# Altium schematic sheet KorszeOBD.SchDoc
size A4
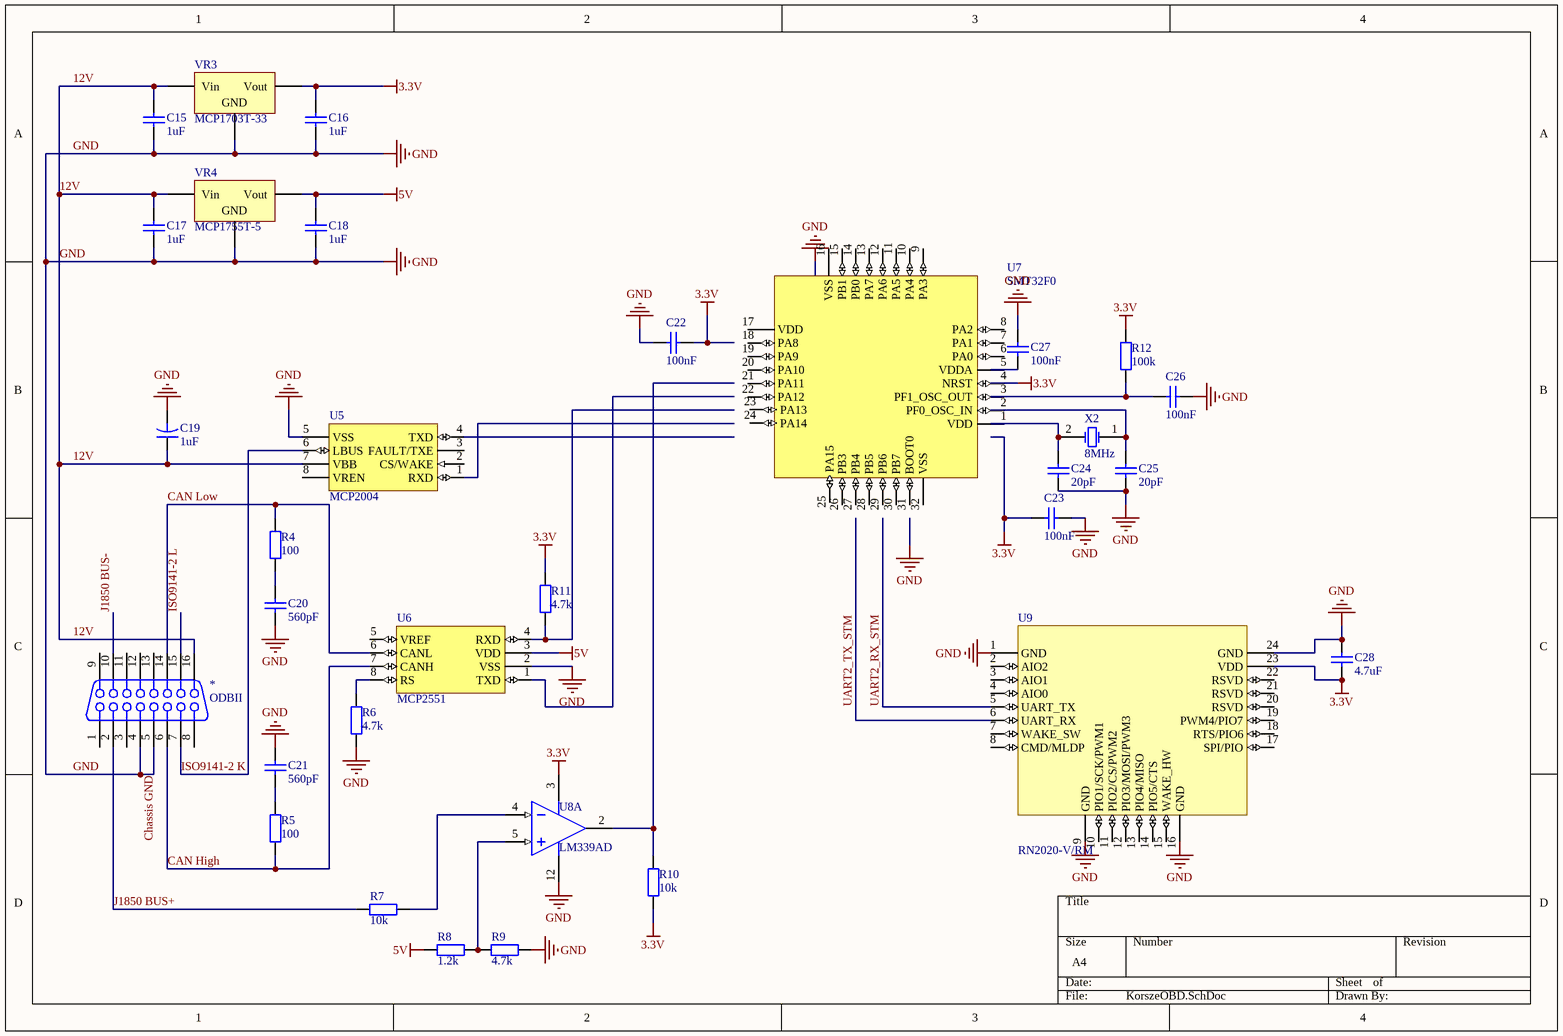
[diagram p0: KorszeOBD.SchDoc]

## Parts
*  ODBII  [HDR2X8H]
C15  1uF  [0402]
C16  1uF  [0402]
C17  1uF  [0402]
C18  1uF  [0402]
C19  1uF  [0402]
C20  560pF  [0402]
C21  560pF  [0402]
C22  100nF  [0402]
C23  100nF  [0402]
C24  20pF  [0402]
C25  20pF  [0402]
C26  100nF  [0402]
C27  100nF  [0402]
C28  4.7uF  [0402]
R4  100  [J1-0603]
R5  100  [J1-0603]
R6  4.7k  [J1-0603]
R7  10k  [J1-0603]
R8  1.2k  [J1-0603]
R9  4.7k  [J1-0603]
R10  10k  [J1-0603]
R11  4.7k  [J1-0603]
R12  100k  [J1-0603]
U5  MCP2004  [SO8_M]
U6  MCP2551  [SO8W_M]
U7  SMT32F0  [Model Name]
U8  LM339AD  [SO14_M]  (part A of 4)
U9  RN2020-V/RM  [RN4020 MODULE-24]
VR3  MCP1703T-33  [SOT23_M]
VR4  MCP1755T-5  [SOT23-6_M]
X2  8MHz  [R38]

## Nets
3.3V: C16.2 C22.2 C23.2 C28.1 R10.2 R11.1 R12.2 U7.4(NRST) U8.3(V+) U9.23(VDD) VR3.3(Vout)
5V: C18.2 R8.2 U6.3(VDD) VR4.3(Vout)
12V: *.4 *.5 *.16 C15.1 C15.2 C16.1 C17.1 C17.2 C18.1 C19.1 C19.2 C20.1 C21.2 C22.1 C23.1 C24.2 C25.2 C26.2 C27.2 C28.2 R6.1 R9.1 U5.5(VSS) U5.7(VBB) U6.2(VSS) U8.12(V-) U9.1(GND) U9.9(GND) U9.16(GND) U9.24(GND) VR3.1(Vin) VR3.2(GND) VR4.1(Vin) VR4.2(GND)  [also labelled Chassis GND, GND]
CAN High: *.6 R5.1 U6.7(CANH)
CAN Low: *.14 R4.2 U6.6(CANL)
ISO9141-2 K: *.7 U5.6(LBUS)
ISO9141-2 L: *.15
J1850 BUS+: *.2 R7.1
J1850 BUS-: *.10
UART2_RX_STM: U9.5(UART_TX)
UART2_TX_STM: U9.6(UART_RX)
NetC20_2: C20.2 R4.1
NetC21_1: C21.1 R5.2
NetC24_1: C24.1 U7.1(VDD) X2.2(OSC2)
NetC25_1: C25.1 U7.2(PF0_OSC_IN) X2.1(OSC1)
NetC26_1: C26.1 R12.1 U7.3(PF1_OSC_OUT)
NetC27_1: C27.1 U7.5(VDDA)
NetR6_2: R6.2 U6.8(RS)
NetR7_2: R7.2 U8.4(IN-)
NetR8_1: R8.1 R9.2 U8.5(IN+)
NetR10_1: R10.1 U8.2(OUT)
NetR11_2: R11.2 U6.4(RXD)

Not connected (* = marked no-connect by the designer): * 1 3 8 9 11 12 13; U5 1(RXD) 2(CS/WAKE) 3(FAULT/TXE) 4(TXD) 8(VREN); U6 1(TXD) 5(VREF); U7 6(PA0) 7(PA1) 8(PA2) 9(PA3) 10(PA4) 11(PA5) 12(PA6) 13(PA7) 14(PB0) 15(PB1) 16(VSS) 17(VDD) 18(PA8) 19(PA9) 20(PA10) 21(PA11) 22(PA12) 23(PA13) 24(PA14) 25(PA15) 26(PB3) 27(PB4) 28(PB5) 29(PB6) 30(PB7) 31(BOOT0) 32(VSS); U9 2(AIO2) 3(AIO1) 4(AIO0) 7(WAKE_SW) 8(CMD/MLDP) 10(PIO1/SCK/PWM1) 11(PIO2/CS/PWM2) 12(PIO3/MOSI/PWM3) 13(PIO4/MISO) 14(PIO5/CTS) 15(WAKE_HW) 17(SPI/PIO) 18(RTS/PIO6) 19(PWM4/PIO7) 20(RSVD) 21(RSVD) 22(RSVD)

## Library data of the parts
C15-C18 C20-C28 = Cap: Capacitor; Published: 8-Jun-2000; LatestRevisionDate: 17-Jul-2002; LatestRevisionNote: Re-released for DXP Platform.; PackageReference: RAD-0.3; Publisher: Altium Limited; PackageDescription: Radial Cap, Thru-Hole; 2 Leads; 0.3 in Pin Spacing
  C15-C18: Value: 1uF
  C20 C21: Value: 560pF
  C22 C23 C26 C27: Value: 100nF
  C24 C25: Value: 20pF
  C28: Value: 4.7uF
C19 = Cap2: Capacitor; Published: 23-Sep-2002; PackageReference: CAPR5-4X5; Publisher: Altium Limited; PackageDescription: Capacitor; 2 Leads; Value: 1uF
R4-R12 = Res2: Resistor; Published: 8-Jun-2000; LatestRevisionDate: 17-Jul-2002; LatestRevisionNote: Re-released for DXP Platform.; PackageReference: AXIAL-0.4; Publisher: Altium Limited; PackageDescription: Axial Device, Thru-Hole; 2 Leads; 0.4 in Pin Spacing
  R4 R5: Value: 100
  R6 R9 R11: Value: 4.7k
  R7 R10: Value: 10k
  R8: Value: 1.2k
  R12: Value: 100k
U5 = MCP2004A-E/SN: LIN Transceiver Michrochip Technology MCP2004A-E/SN
U6 = MCP2551-E/SN: CAN Transceiver Michrochip Technology MCP2551-E/SN
U7 = STM32F030K6T6
U8 = LM339AD: Low-Power Quad Voltage Comparator; Published: 24-Aug-2001; LatestRevisionDate: 13-Apr-2006; LatestRevisionNote: IPC-7351 Footprint Added.; DatasheetVersion: Jun-1998; PackageVersion: Sep-1998; PackageReference: SO14; Publisher: Altium Limited; PackageDescription: 14-Pin Small Outline Integrated Circuit 1.27 mm Pitch; Code_IPC: SOIC127P600-14; ComponentLink1Description: Manufacturer Link; ComponentLink1URL: http://www.st.com/; ComponentLink2Description: Datasheet; ComponentLink2URL: http://www.st.com/stonline/products/literature/ds/2159/lm239.pdf
U9 = RN2020-V/RM123: Microchip RN4020 Bluetooth
VR3 VR4 = Volt Reg: Voltage Regulator; Published: 24-Mar-1999; LatestRevisionDate: 29-May-2009; LatestRevisionNote: IPC-7351 Footprint Added.; PackageReference: D2PAK; Publisher: Altium Limited; PackageDescription: 3-Pin Transistor Outline Package 2.54 mm Pitch, 15.1 mm Lead Span
X2 = XTAL: Crystal Oscillator; Published: 8-Jun-2000; LatestRevisionDate: 17-Jul-2002; LatestRevisionNote: Re-released for DXP Platform.; PackageReference: R38; Publisher: Altium Limited; PackageDescription: Crystal, Thru-Hole; 2 Leads; Body 3.1 x 8.2 mm (Dia.xH)